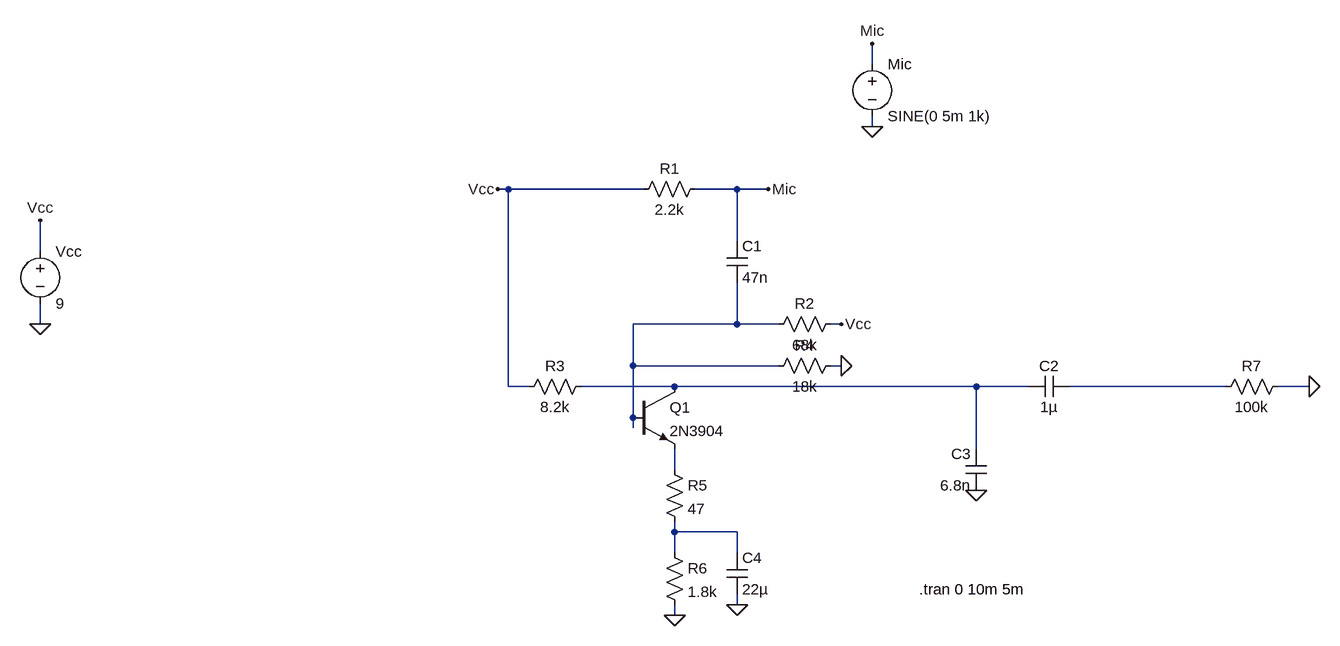
[diagram p0: schematic Low-Noise Analog Baseband.asc]
Low-Noise Analog Baseband.asc, the LTspice schematic file:
Version 4.1
SHEET 1 1748 680
WIRE 1056 -288 1056 -320
WIRE 1056 -192 1056 -208
WIRE 496 -96 480 -96
WIRE 704 -96 496 -96
WIRE 848 -96 784 -96
WIRE 896 -96 848 -96
WIRE 848 -16 848 -96
WIRE -224 0 -224 -48
WIRE -224 112 -224 80
WIRE 848 112 848 48
WIRE 848 112 688 112
WIRE 912 112 848 112
WIRE 1008 112 992 112
WIRE 688 176 688 112
WIRE 912 176 688 176
WIRE 1008 176 992 176
WIRE 496 208 496 -96
WIRE 528 208 496 208
WIRE 752 208 608 208
WIRE 1216 208 752 208
WIRE 1296 208 1216 208
WIRE 1600 208 1360 208
WIRE 1728 208 1680 208
WIRE 688 256 688 176
WIRE 688 272 688 256
WIRE 1216 304 1216 208
WIRE 752 336 752 304
WIRE 752 432 752 416
WIRE 848 432 752 432
WIRE 752 464 752 432
WIRE 848 464 848 432
WIRE 848 544 848 528
WIRE 752 560 752 544
FLAG -224 112 0
FLAG -224 -48 Vcc
FLAG 896 -96 Mic
FLAG 480 -96 Vcc
FLAG 1056 -192 0
FLAG 1056 -320 Mic
FLAG 1216 368 0
FLAG 1008 112 Vcc
FLAG 1008 176 0
FLAG 1728 208 0
FLAG 752 560 0
FLAG 848 544 0
DATAFLAG 496 208 ""
DATAFLAG 688 240 ""
DATAFLAG 752 320 ""
DATAFLAG 752 320 ""
DATAFLAG 784 208 ""
DATAFLAG 1392 208 ""
SYMBOL voltage -224 -16 R0
SYMATTR InstName Vcc
SYMATTR Value 9
SYMBOL res 800 -112 R90
WINDOW 0 0 56 VBottom 2
WINDOW 3 32 56 VTop 2
SYMATTR InstName R1
SYMATTR Value 2.2k
SYMBOL voltage 1056 -304 R0
WINDOW 123 0 0 Left 0
WINDOW 39 0 0 Left 0
SYMATTR InstName Mic
SYMATTR Value SINE(0 5m 1k)
SYMBOL cap 832 -16 R0
SYMATTR InstName C1
SYMATTR Value 47n
SYMBOL res 1008 96 R90
WINDOW 0 0 56 VBottom 2
WINDOW 3 32 56 VTop 2
SYMATTR InstName R2
SYMATTR Value 68k
SYMBOL npn 688 208 R0
SYMATTR InstName Q1
SYMATTR Value 2N3904
SYMBOL res 624 192 R90
WINDOW 0 0 56 VBottom 2
WINDOW 3 32 56 VTop 2
SYMATTR InstName R3
SYMATTR Value 8.2k
SYMBOL res 1008 160 R90
WINDOW 0 0 56 VBottom 2
WINDOW 3 32 56 VTop 2
SYMATTR InstName R4
SYMATTR Value 18k
SYMBOL cap 1360 192 R90
WINDOW 0 0 32 VBottom 2
WINDOW 3 32 32 VTop 2
SYMATTR InstName C2
SYMATTR Value 1µ
SYMBOL cap 1232 368 R180
WINDOW 0 24 56 Left 2
WINDOW 3 24 8 Left 2
SYMATTR InstName C3
SYMATTR Value 6.8n
SYMBOL res 736 320 R0
SYMATTR InstName R5
SYMATTR Value 47
SYMBOL res 1696 192 R90
WINDOW 0 0 56 VBottom 2
WINDOW 3 32 56 VTop 2
SYMATTR InstName R7
SYMATTR Value 100k
SYMBOL res 736 448 R0
SYMATTR InstName R6
SYMATTR Value 1.8k
SYMBOL cap 832 464 R0
SYMATTR InstName C4
SYMATTR Value 22µ
TEXT 1128 520 Left 2 !.tran 0 10m 5m

The netlist it stands for:
* Low-Noise Analog Baseband.asc
Vcc Vcc 0 9
R1 Mic Vcc 2.2k
V§Mic Mic 0 SINE(0 5m 1k)
C1 Mic N001 47n
R2 Vcc N001 68k
Q1 N002 N001 N004 0 2N3904
R3 N002 Vcc 8.2k
R4 0 N001 18k
C2 N003 N002 1µ
C3 0 N002 6.8n
R5 N004 N005 47
R7 0 N003 100k
R6 N005 0 1.8k
C4 N005 0 22µ
.model NPN NPN
.model PNP PNP
.lib standard.bjt
.tran 0 10m 5m
.backanno
.end